# EAGLE schematic BH_Pzem_WI_FI_SHIELD (EAGLE 9.2.2)
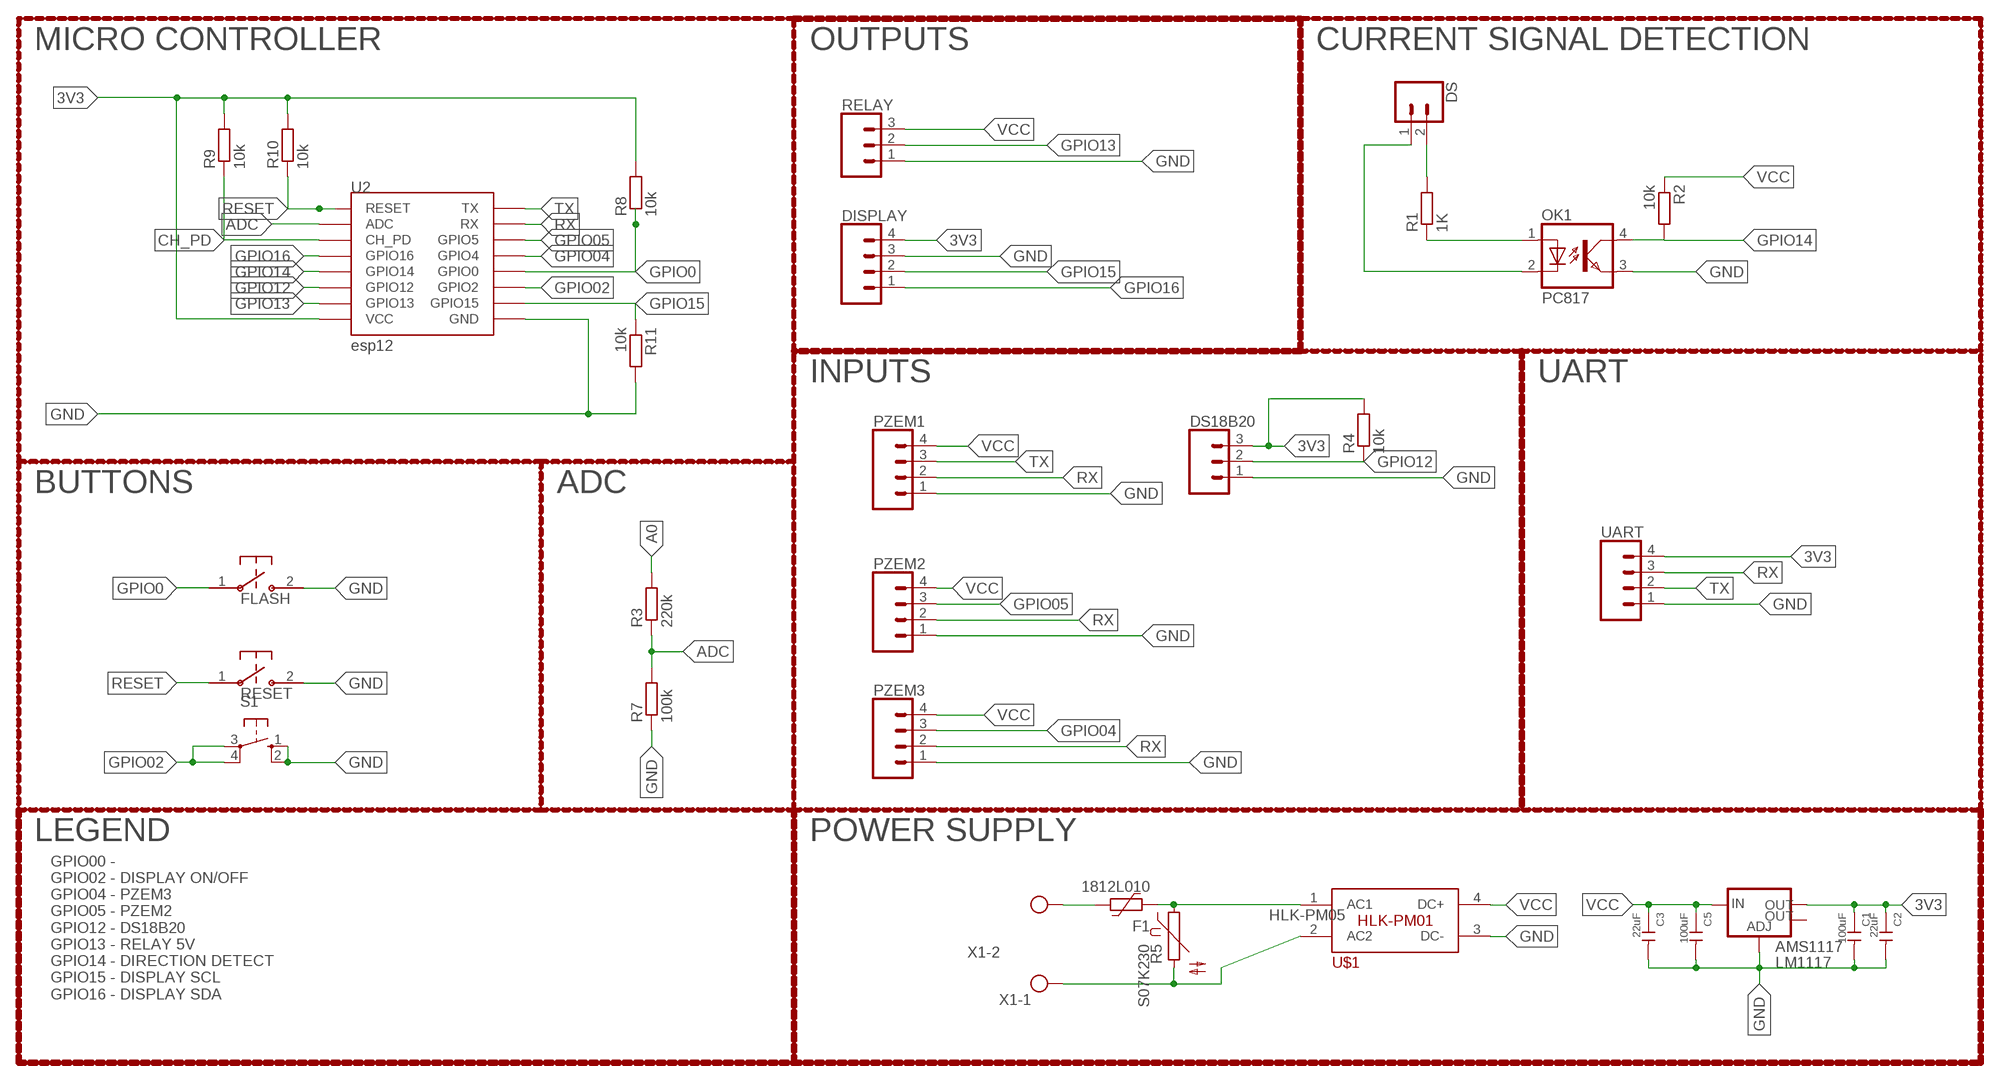
[diagram p0: schematic, sheet 1]

## Parts
AMS1117  LM1117  V_REG_LM1117SOT223  [SOT223]
C1  100uF  CERAMIC-1NF-1KV-10%-X7R(1206)  [C1206]
C2  22uF  CERAMIC-1NF-1KV-10%-X7R(1206)  [C1206]
C3  22uF  CERAMIC-1NF-1KV-10%-X7R(1206)  [C1206]
C5  100uF  CERAMIC-1NF-1KV-10%-X7R(1206)  [C1206]
DISPLAY  CONN_04JST-PTH-VERT  [JST-4-PTH-VERT]
DS  CONN_02  [1X02]
DS18B20  CONN_03JST-PTH-VERT  [JST-3-PTH-VERT]
F1  1812L010  [1812L]
FLASH  B3U-1000P-2P-SMD  B3U-1000P  [B3U-1000P]
OK1  PC817  [DIL04]
PZEM1  CONN_04JST-PTH-VERT  [JST-4-PTH-VERT]
PZEM2  CONN_04JST-PTH-VERT  [JST-4-PTH-VERT]
PZEM3  CONN_04JST-PTH-VERT  [JST-4-PTH-VERT]
R1  1K  R-EU_R0603  [R0603]
R2  10k  R-EU_R0603  [R0603]
R3  220k  R-EU_R0603  [R0603]
R4  10k  R-EU_R0603  [R0603]
R5  S07K230  [S07K230]
R7  100k  R-EU_R0603  [R0603]
R8  10k  R-EU_R0603  [R0603]
R9  10k  R-EU_R0603  [R0603]
R10  10k  R-EU_R0603  [R0603]
R11  10k  R-EU_R0603  [R0603]
RELAY  CONN_03JST-PTH-VERT  [JST-3-PTH-VERT]
RESET  B3U-1000P-2P-SMD  B3U-1000P  [B3U-1000P]
S1  10-XX  [B3F-10XX]
U2  esp12  ESP12SMD  [ESP12-SMD]
U$1  HLK-PM01  [HLK-PM01]
UART  CONN_04JST-PTH-VERT  [JST-4-PTH-VERT]
X1  W237-102  [W237-102]

## Nets
3V3: AMS1117.2(OUT) C1.1 C2.1 DISPLAY.4 DS18B20.3 R4.2 R8.2 R9.2 R10.2 U2.VCC UART.4
A0: R3.2
ADC: R3.1 R7.2 U2.ADC
CH_PD: R9.1 U2.CH_PD
GND: AMS1117.1(ADJ) C1.2 C2.2 C3.2 C5.2 DISPLAY.3 DS18B20.1 FLASH.2 OK1.3(EMIT) PZEM1.1 PZEM2.1 PZEM3.1 R7.1 R11.2 RELAY.1 RESET.2 S1.1(S) S1.2(S1) U2.GND U$1.3(DC-) UART.1
GPIO0: FLASH.1 R8.1 U2.GPIO0
GPIO02: S1.3(P) S1.4(P1) U2.GPIO2
GPIO04: PZEM3.3 U2.GPIO4
GPIO05: PZEM2.3 U2.GPIO5
GPIO12: DS18B20.2 R4.1 U2.GPIO12
GPIO13: RELAY.2 U2.GPIO13
GPIO14: OK1.4(COL) R2.2 U2.GPIO14
GPIO15: DISPLAY.2 R11.1 U2.GPIO15
GPIO16: DISPLAY.1 U2.GPIO16
LINE_L [220V]: F1.2 R5.1 U$1.1(AC1)
N$1: OK1.1(A) R1.1
N$2: F1.1 X1.2
N$3: DS.2 R1.2
NEUTRAL_IN [220V]: R5.2 U$1.2(AC2) X1.1
RESET: R10.1 RESET.1 U2.RESET
RX: PZEM1.2 PZEM2.2 PZEM3.2 U2.RXD0(RX) UART.3
SIGNAL_GND: DS.1 OK1.2(C)
TX: PZEM1.3 U2.TXD0(TX) UART.2
VCC: AMS1117.3(IN) C3.1 C5.1 PZEM1.4 PZEM2.4 PZEM3.4 R2.1 RELAY.3 U$1.4(DC+)
Unconnected: AMS1117.4(OUT)

## Notes on the sheet
- MICRO CONTROLLER | OUTPUTS | CURRENT SIGNAL DETECTION
- INPUTS | UART
- BUTTONS | ADC
- LEGEND | POWER SUPPLY
- HLK-PM05
- GPIO00 - 
  GPIO02 - DISPLAY ON/OFF
  GPIO04 - PZEM3
  GPIO05 - PZEM2
  GPIO12 - DS18B20
  GPIO13 - RELAY 5V
  GPIO14 - DIRECTION DETECT
  GPIO15 - DISPLAY SCL
  GPIO16 - DISPLAY SDA

## Library data of the parts
AMS1117 = SparkFun-IC-Power:V_REG_LM1117: Voltage Regulator LM1117 Standard adjustable voltage regulator but in SMD form. Spark Fun Electronics SKU : COM-00595; PROD_ID: VREG-08170
C1-C3 C5 = Seeed-Capacitor:CERAMIC-1NF-1KV-10%-X7R?(1206): 302010189; MPN: CC1206KKX7RCBB102; VALUE: 1NF
DISPLAY PZEM1-PZEM3 UART = SparkFun-Connectors:CONN_04: Multi connection point. Often used as Generic Header-pin footprint for 0.1 inch spaced/style header connections On any of the 0.1 inch spaced packages, you can populate with these: Break Away Headers - Straight <https://www.sparkfun.com/products/116> (PRT-00116) Break Away Male Headers - Right Angle <https://www.sparkfun.com/products/553> (PRT-00553) Female Headers <https://www.sparkfun.com/products/115> (PRT-00115) Break Away Headers - Machine Pin <https://www.sparkfun.com/products/117> (PRT-00117) Break Away Female Headers - Swiss Machine Pin <https://www.sparkfun.com/products/743> (PRT-00743) For SCREWTERMINALS and SPRING TERMINALS visit here: Screw Terimnals on SparkFun.com <https://www.sparkfun.com/search/results?term=Screw+Terminals> (5mm/3.5mm/2.54mm spacing) This device is also useful as a general connection point to wire up your design to another part of your project. Our various solder wires solder well into these plated through hole pads. Hook-Up Wire - Assortment (Stranded, 22 AWG) <https://www.sparkfun.com/products/11375> (PRT-11375) Hook-Up Wire - Assortment (Solid Core, 22 AWG) <https://www.sparkfun.com/products/11367> (PRT-11367) View the entire wire category on our website here <https://www.sparkfun.com/categories/141> Special notes: Molex polarized connector foot print use with SKU : PRT-08231 with associated crimp pins and housings. 1MM SMD Version SKU: PRT-10208; PROD_ID: CONN-13251
DS = SparkFun-Connectors:CONN_02: Multi connection point. Often used as Generic Header-pin footprint for 0.1 inch spaced/style header connections On any of the 0.1 inch spaced packages, you can populate with these: Break Away Headers - Straight <https://www.sparkfun.com/products/116> (PRT-00116) Break Away Male Headers - Right Angle <https://www.sparkfun.com/products/553> (PRT-00553) Female Headers <https://www.sparkfun.com/products/115> (PRT-00115) Break Away Headers - Machine Pin <https://www.sparkfun.com/products/117> (PRT-00117) Break Away Female Headers - Swiss Machine Pin <https://www.sparkfun.com/products/743> (PRT-00743) For SCREWTERMINALS and SPRING TERMINALS visit here: Screw Terimnals on SparkFun.com <https://www.sparkfun.com/search/results?term=Screw+Terminals> (5mm/3.5mm/2.54mm spacing) This device is also useful as a general connection point to wire up your design to another part of your project. Our various solder wires solder well into these plated through hole pads. Hook-Up Wire - Assortment (Stranded, 22 AWG) <https://www.sparkfun.com/products/11375> (PRT-11375) Hook-Up Wire - Assortment (Solid Core, 22 AWG) <https://www.sparkfun.com/products/11367> (PRT-11367) View the entire wire category on our website here <https://www.sparkfun.com/categories/141> Special notes: Molex polarized connector foot print use with: PRT-08233 with associated crimp pins and housings. 2.54_SCREWTERM for use with PRT-10571. 3.5mm Screw Terminal footprints for PRT-08084 5mm Screw Terminal footprints for use with PRT-08432
DS18B20 RELAY = SparkFun-Connectors:CONN_03: Multi connection point. Often used as Generic Header-pin footprint for 0.1 inch spaced/style header connections On any of the 0.1 inch spaced packages, you can populate with these: Break Away Headers - Straight <https://www.sparkfun.com/products/116> (PRT-00116) Break Away Male Headers - Right Angle <https://www.sparkfun.com/products/553> (PRT-00553) Female Headers <https://www.sparkfun.com/products/115> (PRT-00115) Break Away Headers - Machine Pin <https://www.sparkfun.com/products/117> (PRT-00117) Break Away Female Headers - Swiss Machine Pin <https://www.sparkfun.com/products/743> (PRT-00743) Stackable Header - 3 Pin (Female, 0.1") <https://www.sparkfun.com/products/13875> (PRT-13875) For SCREWTERMINALS and SPRING TERMINALS visit here: Screw Terimnals on SparkFun.com <https://www.sparkfun.com/search/results?term=Screw+Terminals> (5mm/3.5mm/2.54mm spacing) This device is also useful as a general connection point to wire up your design to another part of your project. Our various solder wires solder well into these plated through hole pads. Hook-Up Wire - Assortment (Stranded, 22 AWG) <https://www.sparkfun.com/products/11375> (PRT-11375) Hook-Up Wire - Assortment (Solid Core, 22 AWG) <https://www.sparkfun.com/products/11367> (PRT-11367) View the entire wire category on our website here <https://www.sparkfun.com/categories/141> Special notes: Molex polarized connector foot print use with SKU : PRT-08232 with associated crimp pins and housings.; PROD_ID: CONN-13230
F1 = polyfuse-smd_10:?: Polyfuse Resettable PTC Source: http://www.littelfuse.com/products/resettable-ptcs.aspx; MF: Littelfuse; MPN: 1812L010; OC_FARNELL: 1822210; OC_NEWARK: 78R5551
FLASH = switches:B3U: Switch; DIGIKEY: SW1020CT-ND; MANUFACTURER: Omron; MPN: B3U-1000P; SPICEPREFIX: F
OK1 = optocoupler:PC817: SHARP OPTO COUPLER; MPN: PC817X4J000F; OC_FARNELL: 9707727; OC_NEWARK: 97K7059
R1-R4 R7-R11 = resistor:R-EU_: RESISTOR, European symbol
R5 = VARISTORESBH:S07K230: VARISTOR
RESET = switches:B3U: Switch; DIGIKEY: SW1020CT-ND; MANUFACTURER: Omron; MPN: B3U-1000P
S1 = switch-omron:10-XX: OMRON SWITCH; MPN: B3F-1000; OC_FARNELL: 176432; OC_NEWARK: 36M3542
U2 = esp8266modules:ESP12: ESP8266 Wifi module 12
U$1 = HLK-PM01:HLK-PM01; AVAILABILITY: Unavailable; MF: Hi-link; MP: hlk-pm01; PACKAGE: Package Analog Devices; PRICE: None
X1 = con-wago-500:W237-102: WAGO SCREW CLAMP; MPN: 237-102; OC_FARNELL: unknown; OC_NEWARK: 70K9898

## Net classes
1 220V: width 1.27 mm, clearance 2 mm